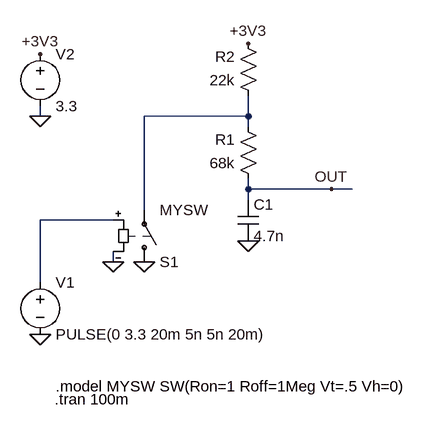
[diagram p0: schematic debounce.asc]
debounce.asc, the LTspice schematic file:
Version 4
SHEET 1 880 680
WIRE 0 -144 0 -160
WIRE 320 -144 320 -176
WIRE 320 -144 160 -144
WIRE 320 -128 320 -144
WIRE 320 -32 320 -48
WIRE 448 -32 320 -32
WIRE 480 -32 448 -32
WIRE 320 -16 320 -32
WIRE 160 0 160 -144
WIRE 112 16 0 16
WIRE 112 80 112 64
WIRE 0 112 0 16
FLAG 0 192 0
FLAG 160 80 0
FLAG 112 80 0
FLAG 320 48 0
FLAG 0 -144 0
FLAG 0 -240 +3V3
FLAG 320 -256 +3V3
FLAG 448 -32 OUT
SYMBOL voltage 0 96 R0
WINDOW 123 0 0 Left 0
WINDOW 39 0 0 Left 0
SYMATTR InstName V1
SYMATTR Value PULSE(0 3.3 20m 5n 5n 20m)
SYMBOL sw 160 96 M180
SYMATTR InstName S1
SYMATTR Value MYSW
SYMBOL res 336 -160 R180
WINDOW 0 36 76 Left 2
WINDOW 3 36 40 Left 2
SYMATTR InstName R2
SYMATTR Value 22k
SYMBOL res 336 -32 R180
WINDOW 0 36 76 Left 2
WINDOW 3 36 40 Left 2
SYMATTR InstName R1
SYMATTR Value 68k
SYMBOL cap 304 -16 R0
SYMATTR InstName C1
SYMATTR Value 4.7n
SYMBOL voltage 0 -256 R0
WINDOW 123 0 0 Left 0
WINDOW 39 0 0 Left 0
SYMATTR InstName V2
SYMATTR Value 3.3
TEXT 24 272 Left 2 !.model MYSW SW(Ron=1 Roff=1Meg Vt=.5 Vh=0)
TEXT 22 292 Left 2 !.tran 100m

The netlist it stands for:
* debounce.asc
V1 N002 0 PULSE(0 3.3 20m 5n 5n 20m)
S1 0 N001 N002 0 MYSW
R2 N001 +3V3 22k
R1 OUT N001 68k
C1 OUT 0 4.7n
V2 +3V3 0 3.3
.model MYSW SW(Ron=1 Roff=1Meg Vt=.5 Vh=0)
.tran 100m
.backanno
.end